# EAGLE design pmod-apa102 (EAGLE 7.7.0)
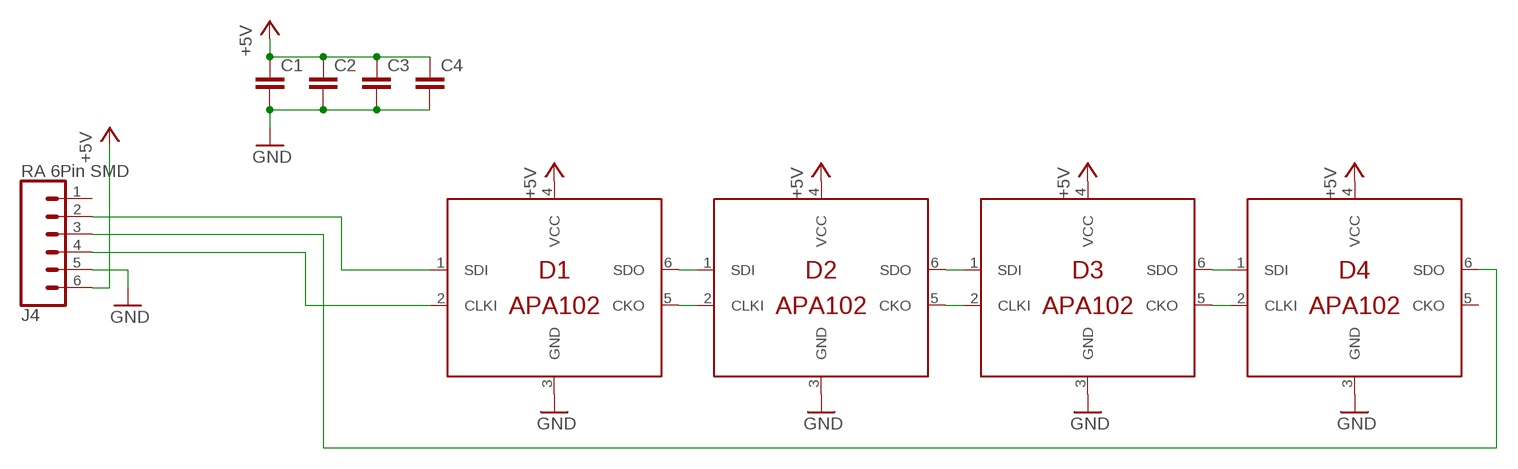
[diagram p0: schematic, sheet 1]

## Parts
C1  C-EUC0805K  [C0805K]
C2  C-EUC0805K  [C0805K]
C3  C-EUC0805K  [C0805K]
C4  C-EUC0805K  [C0805K]
D1  APA102  [RGBLED5050]
D2  APA102  [RGBLED5050]
D3  APA102  [RGBLED5050]
D4  APA102  [RGBLED5050]
J4  RA 6Pin SMD  CONN_06SMD  [1X06-SMD_RA_MALE]

## Nets
+5V: C1.1 C2.1 C3.1 C4.1 D1.4(VCC) D2.4(VCC) D3.4(VCC) D4.4(VCC) J4.6
CLKI2: D1.5(CKO) D2.2(CLKI)
CLKI3: D2.5(CKO) D3.2(CLKI)
CLKI4: D3.5(CKO) D4.2(CLKI)
GND: C1.2 C2.2 C3.2 C4.2 D1.3(GND) D2.3(GND) D3.3(GND) D4.3(GND) J4.5
MISO: D4.6(SDO) J4.3
MOSI: D1.1(SDI) J4.2
SCK: D1.2(CLKI) J4.4
SDI2: D1.6(SDO) D2.1(SDI)
SDI3: D2.6(SDO) D3.1(SDI)
SDI4: D3.6(SDO) D4.1(SDI)
Unconnected: D4.5(CKO) J4.1

## Library data of the parts
C1-C4 = rcl:C-EU: CAPACITOR, European symbol
D1-D4 = semiconductors:APA102
J4 = mechanical:CONN_06: Multi connection point. Often used as Generic Header-pin footprint for 0.1 inch spaced/style header connections On any of the 0.1 inch spaced packages, you can populate with these: Break Away Headers - Straight <https://www.sparkfun.com/products/116> (PRT-00116) Break Away Male Headers - Right Angle <https://www.sparkfun.com/products/553> (PRT-00553) Female Headers <https://www.sparkfun.com/products/115> (PRT-00115) Break Away Headers - Machine Pin <https://www.sparkfun.com/products/117> (PRT-00117) Break Away Female Headers - Swiss Machine Pin <https://www.sparkfun.com/products/743> (PRT-00743) Arduino Stackable Header - 6 Pin <https://www.sparkfun.com/products/9280> (PRT-09280) For SCREWTERMINALS and SPRING TERMINALS visit here: Screw Terimnals on SparkFun.com <https://www.sparkfun.com/search/results?term=Screw+Terminals> (5mm/3.5mm/2.54mm spacing) This device is also useful as a general connection point to wire up your design to another part of your project. Our various solder wires solder well into these plated through hole pads. Hook-Up Wire - Assortment (Stranded, 22 AWG) <https://www.sparkfun.com/products/11375> (PRT-11375) Hook-Up Wire - Assortment (Solid Core, 22 AWG) <https://www.sparkfun.com/products/11367> (PRT-11367) View the entire wire category on our website here <https://www.sparkfun.com/categories/141>; PROD_ID: CONN-08971

## Board
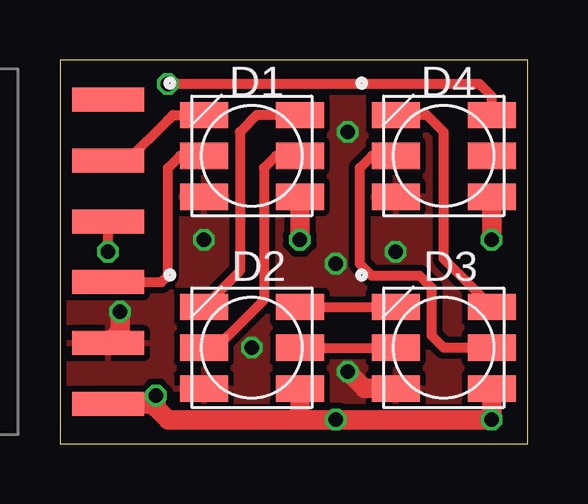
[diagram p1: board, top side]
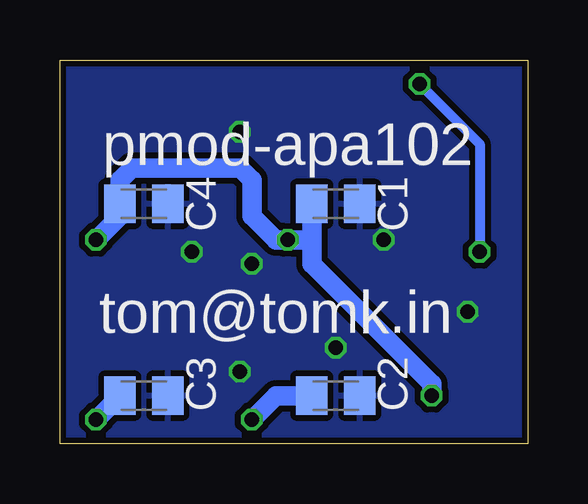
[diagram p2: board, bottom side, seen from below]

Size 19.5 x 16 mm. Coordinates in mm from the lower left corner, seen from the top.
Outline: 0,0 19.5,0 19.5,16 0,16 0,0
Copper layers (1*16): Top 0.035mm / dielectric 1.5mm / Bottom 0.035mm
Design rules "dirt_cheap_dirty_boards.v1.1": minimum track width 5mil, minimum drill 12mil, track to track 5mil, track to pad 5mil, pad to pad 5mil, via to via 5mil, smd to smd 0mil, copper to edge 10mil, drill to drill 10mil, minimum pad ring 10mil, minimum via ring 6mil, stop-mask expansion 2mil, vias tented up to drill 25mil, thermal gap 10mil

### Footprints (pad centres in the part's own frame; a part is rotated, then mirrored left to right if it is on the bottom)
C0805K = smd 1.3 x 1.6: 1 -1,0; 2 1,0
RGBLED5050 = smd 2 x 1.1: 1 -2,1.7; 2 -2,0; 3 -2,-1.7; 4 2,-1.7; 5 2,0; 6 2,1.7
1X06-SMD_RA_MALE = smd 1 x 3: 1 -6.35,5; 2 -3.81,5; 3 -1.27,5; 4 1.27,5; 5 3.81,5; 6 6.35,5

### Placement (x,y rotation side)
C1  8,10 0 bottom
C2  8,2 0 bottom
C3  16,2 0 bottom
C4  16,10 0 bottom
D1  8,12 0 top
D2  8,4 0 top
D3  16,4 0 top
D4  16,12 0 top
J4  -3,8 270 top

### Tracks (layer width: path | path; a pad name or v marks a point on that pad's centre or on a via)
+5V  (via drill 0.6)
  Top 0.813: J4.6 3.65,1.65 v4,2 4,1.5 4.5,1 10,1 | D1.4 v10,8.5 | D4.4 v18,8.5 | D3.4 v18,1 16.7,1 12,1 v11.5,1 11,1 10,1 | D2.4 10,1
  Bottom 0.813: v4,2 4,2.5 9,7.5 9,8.5 | 9,8.5 C1.1 | 9,8.5 v10,8.5 10.5,8.5 11.5,9.5 11.5,11 12,11.5 16.5,11.5 17,11 C4.1 17,9.5 v18,8.5 | v11.5,1 10.5,2 C2.1 | C3.1 v18,1
CLKI2
  Top 0.406: D1.5 9,12 8.5,11.5 8.5,6 7,4.5 6.5,4 D2.2
CLKI3
  Top 0.406: D2.5 D3.2
CLKI4
  Top 0.406: D3.5 16,4 15.5,4.5 15.5,6.5 15,7 13,7 12.5,7.5 12.5,11.5 13,12 D4.2
GND  (via drill 0.6)
  Top 0.813: J4.5 2.5,4.69 v2.5,5.5 | v12,3 12.7,2.3 D3.3
  other vias: 14,8 11.5,7.5 12,13 8,4 6,8.5
  pour Bottom (isolate 0.254): 0,17 20,17 20,0 0,0
  pour Top (isolate 0.254): 0,17 20,17 20,0 0,0
MISO  (via drill 0.6)
  Top 0.406: D4.6 18,14.5 17.5,15 v4.5,15 | v2,8 J4.3
  Bottom 0.406: v4.5,15 2,12.5 v2,8
MOSI
  Top 0.406: J4.2 2.81,11.81 4.5,13.5 4.7,13.7 D1.1
SCK
  Top 0.406: J4.4 4.23,6.73 4.5,7 4.5,11.5 5,12 D1.2
SDI2
  Top 0.406: D1.6 8.2,13.7 7.5,13 7.5,7.2 D2.1
SDI3
  Top 0.406: D2.6 D3.1
SDI4
  Top 0.406: D3.6 16,7.7 16,13 15.3,13.7 D4.1

### Text on the board
bPlace: pmod-apa102 | tom@tomk.in